# Altium project EncoderDaughter.PrjPCB
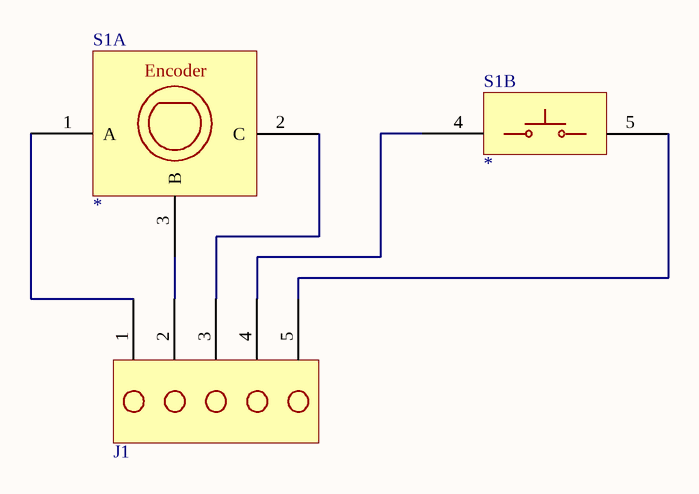
[diagram p0: EncoderDaughter.SchDoc]
1 sheet, 2 parts. Net scope: global (net labels, ports and power ports of the same name join across sheets).
Board file: EncoderDaughter.PcbDoc

## Sheet EncoderDaughter.SchDoc
size A

### Parts
J1  J_RIBBCONN_RIBBCONN  [RIBBCONN]  (value not drawn)
S1  S_QUADENC_PEC11-4215F-S24  [PEC11-4215F-S24]  (value not drawn)  (parts A,B of 2)

### Nets
NetJ1_1: J1.1 S1.1(A)
NetJ1_2: J1.2 S1.3(B)
NetJ1_3: J1.3 S1.2(C)
NetJ1_4: J1.4 S1.4
NetJ1_5: J1.5 S1.5

### Notes on the sheet
- (in symbol S_QUADENC_PEC11-4215F-S24, part A) Encoder

### Library data of the parts
S1 = S_QUADENC_PEC11-4215F-S24: PartNumber: *